# EAGLE design C128_Ultimate (EAGLE 9.0.1)
CNAME: Uffes Cart; CREVISION: 1.0; DESIGNER: Tomse @ http://retro-commodore.eu
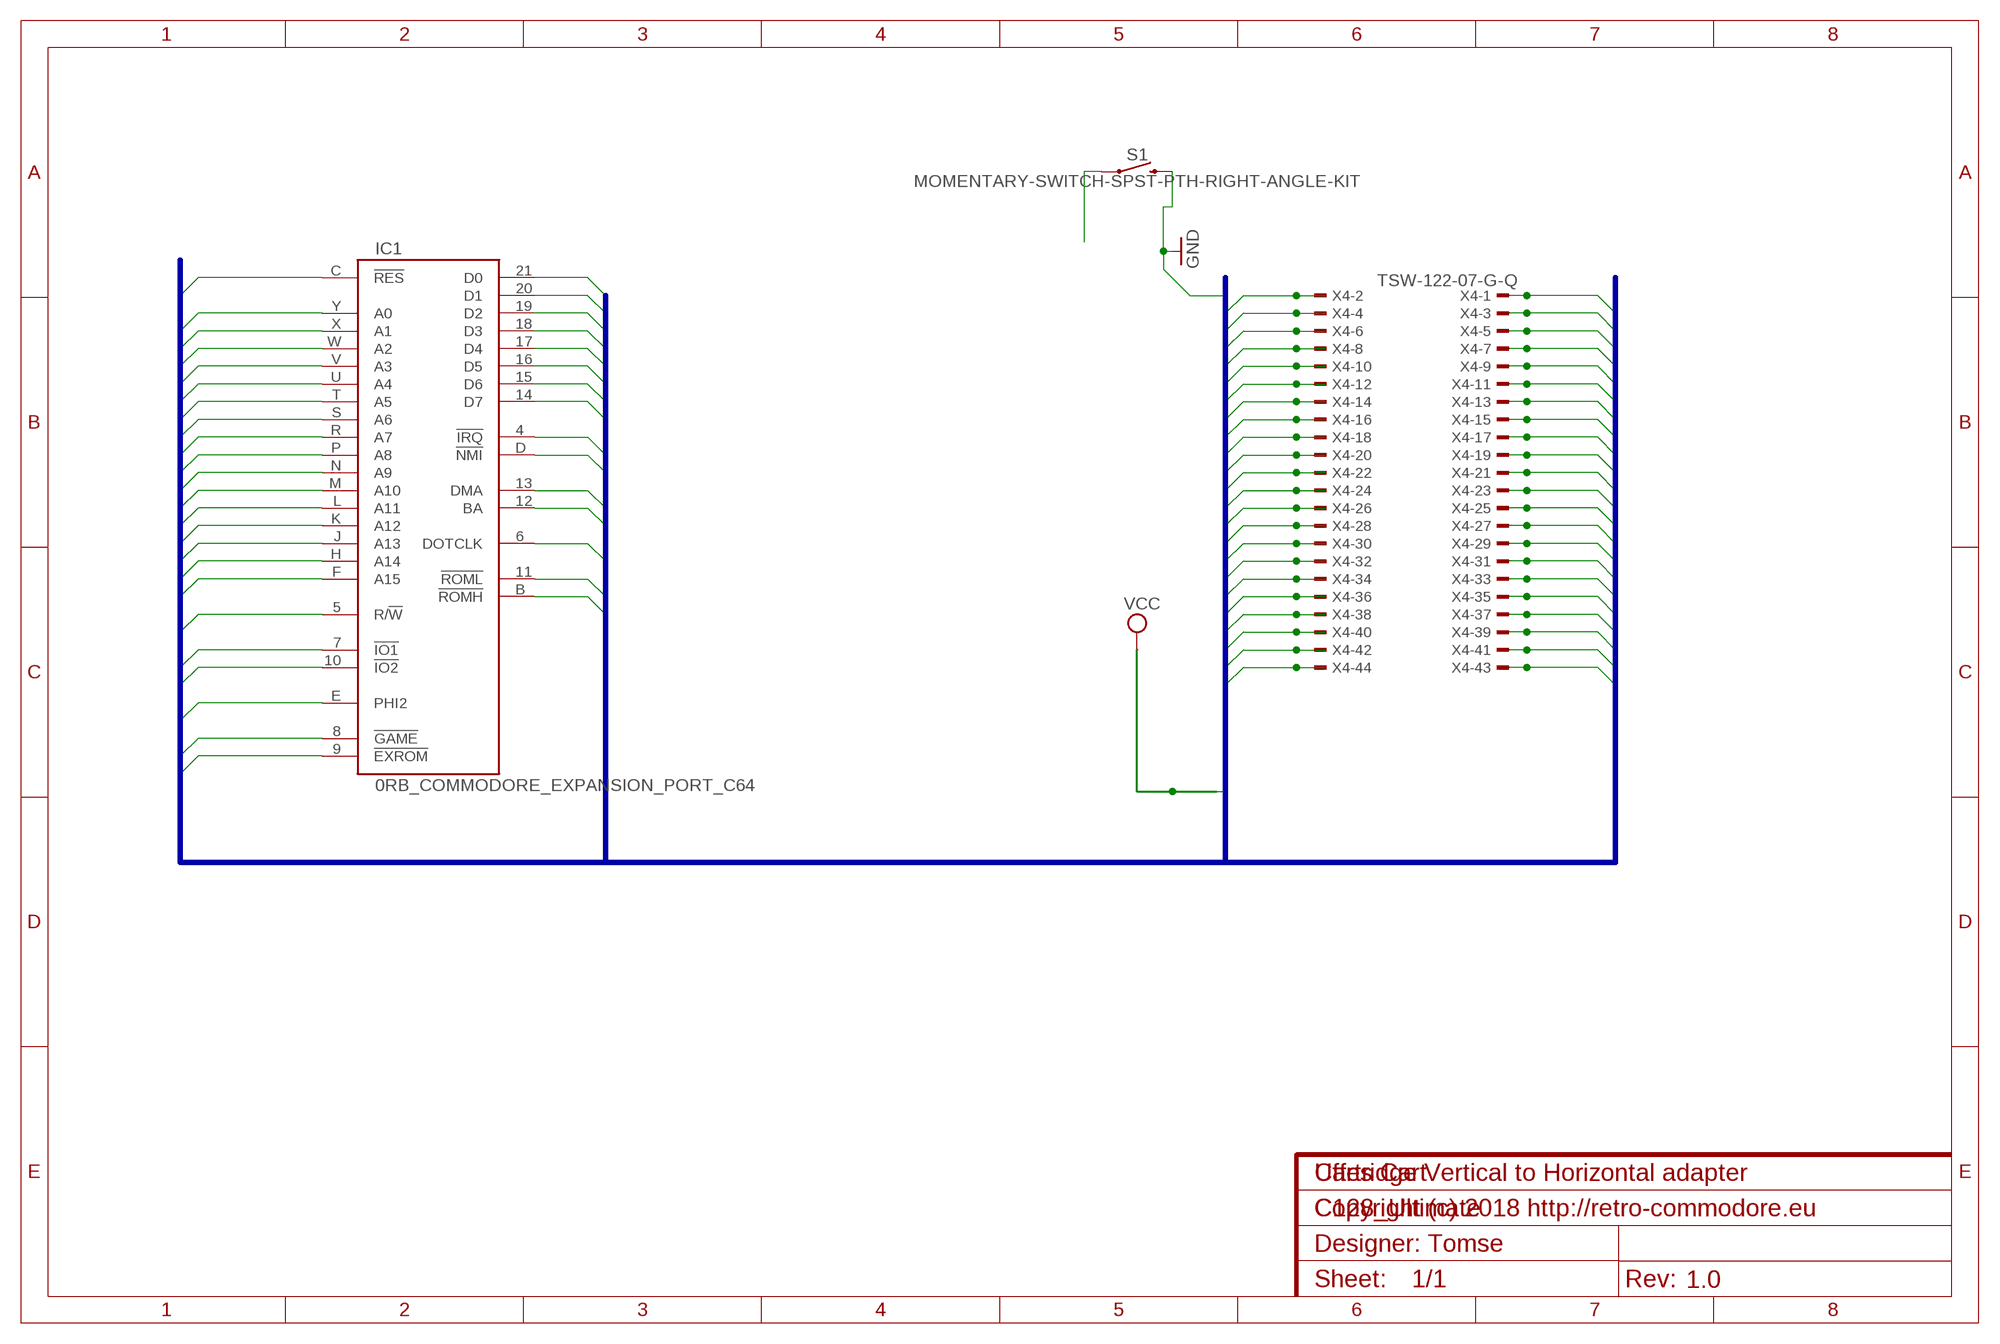
[diagram p0: schematic, sheet 1]
FRAME1 (FRAME-A4L): DESIGNER: Copyright (c) 2018 http://retro-commodore.eu

## Parts
IC1  0RB_COMMODORE_EXPANSION_PORT_C64  [0RB_COMMODORE_MA100-22-2]
S1  MOMENTARY-SWITCH-SPST-PTH-RIGHT-ANGLE-KIT  [TACTILE_SWITCH_PTH_RIGHT_ANGLE_KIT]
X4  TSW-122-07-G-Q  [TSW-122-XX-G-Q]

## Nets
!DMA: IC1.13(DMA) X4.26
!EXROM: IC1.9(!EXROM) X4.18
!GAME: IC1.8(!GAME) X4.16
!IO1: IC1.7(!IO1) X4.14
!IO2: IC1.10(!IO2) X4.20
!IRQ: IC1.4(!IRQ) X4.8
!NMI: IC1.D(!NMI) X4.7
!RES: IC1.C(!RES) S1.1 X4.5
!ROMH: IC1.B(!ROMH) X4.3
!ROML: IC1.11(!ROML) X4.22
A0: IC1.Y(A0) X4.41
A1: IC1.X(A1) X4.39
A2: IC1.W(A2) X4.37
A3: IC1.V(A3) X4.35
A4: IC1.U(A4) X4.33
A5: IC1.T(A5) X4.31
A6: IC1.S(A6) X4.29
A7: IC1.R(A7) X4.27
A8: IC1.P(A8) X4.25
A9: IC1.N(A9) X4.23
A10: IC1.M(A10) X4.21
A11: IC1.L(A11) X4.19
A12: IC1.K(A12) X4.17
A13: IC1.J(A13) X4.15
A14: IC1.H(A14) X4.13
A15: IC1.F(A15) X4.11
BA: IC1.12(BA) X4.24
D0: IC1.21(D0) X4.42
D1: IC1.20(D1) X4.40
D2: IC1.19(D2) X4.38
D3: IC1.18(D3) X4.36
D4: IC1.17(D4) X4.34
D5: IC1.16(D5) X4.32
D6: IC1.15(D6) X4.30
D7: IC1.14(D7) X4.28
DOTCLK: IC1.6(DOTCLK) X4.12
GND: S1.2 X4.1 X4.2 X4.43 X4.44
PHI2: IC1.E(PHI2) X4.9
R!W: IC1.5(R/!W) X4.10
VCC: X4.4 X4.6

## Buses
A0,A1,A2,A3,A4,A5,A6,A7,A8,A9,A10,A11,A12,A13,A14,A15,PHI2,!NMI,!RES,!ROMH,GND,D0,D1,D2,D3,D4,D5,D6,D7,VCC,!IRQ,R!W,DOTCLK,!IO1,!IO2,!GAME,!EXROM,!ROML,BA,!DMA

## Notes on the sheet
- Cartridge Vertical to Horizontal adapter
- Designer: Tomse

## Power pins joined to a net without a drawn wire
GND: IC1.1(GND) IC1.22(GND) IC1.A(GND) IC1.Z(GND)
VCC: IC1.2(VCC) IC1.3(VCC)

## Library data of the parts
IC1 = C64CartridgeEdgeConnector:0RB_COMMODORE_EXPANSION_PORT_C64
S1 = SparkFun-Switches:MOMENTARY-SWITCH-SPST: Momentary Switch (Pushbutton) - SPST Normally-open (NO) SPST momentary switches (buttons, pushbuttons). Variants PTH-12MM - 12mm square, through-hole Momentary Pushbutton Switch - 12mm Square <https://www.sparkfun.com/products/9190> (COM-09190) PTH-6.0MM, PTH-6.0MM-KIT - 6.0mm square, through-hole Mini Pushbutton Switch <https://www.sparkfun.com/products/97> (COM-00097) KIT package intended for soldering kit's - only one side of pads' copper is exposed. PTH-RIGHT-ANGLE-KIT - Right-angle, through-hole Right Angle Tactile Button <https://www.sparkfun.com/products/10791> - Used on SparkFun BigTime Watch Kit <https://www.sparkfun.com/products/11734> SMD-12MM - 12mm square, surface-mount Tactile Button - SMD (12mm) <https://www.sparkfun.com/products/12993> (COM-12993) Used on SparkFun PicoBoard <https://www.sparkfun.com/products/11888> SMD-4.5MM - 4.5mm Square Trackball Switch Used on SparkFun Blackberry Trackballer Breakout <https://www.sparkfun.com/products/13169> SMD-4.6MMX2.8MM - 4.60mm x 2.80mm, surface mount Used on SparkFun SAMD21 Mini Breakout <https://www.sparkfun.com/products/13664> SMD-5.2MM, SMD-5.2-REDUNDANT - 5.2mm square, surface-mount Mini Pushbutton Switch - SMD <https://www.sparkfun.com/products/8720> (COM-08720) Used on Arduino Pro Mini <https://www.sparkfun.com/products/11114> REDUNDANT package connects both switch circuits together SMD-6.0X3.5MM - 6.0 x 3.5mm, surface mount Momentary Reset Switch SMD <https://www.sparkfun.com/products/8229> (COM-08229) SMD-6.2MM-TALL - 6.2mm square, surface mount Tactile Button - SMD (6mm) <https://www.sparkfun.com/products/12992> Used on SparkFun Digital Sandbox <https://www.sparkfun.com/products/12651> SMD-RIGHT-ANGLE - Right-angle, surface mount Used on SparkFun Block for Intel® Edison - Arduino <https://www.sparkfun.com/products/13036>; PROD_ID: CONN-10672; SF_SKU: COM-10791
X4 = con-samtec:TSW-122-*-G: THROUGH-HOLE .025" SQ POST HEADER Source: Samtec TSW.pdf; MF: Samtec Inc.; MPN: TSW-122-07-G-Q

## Net classes
0 default: clearance 0.205 mm

## Board
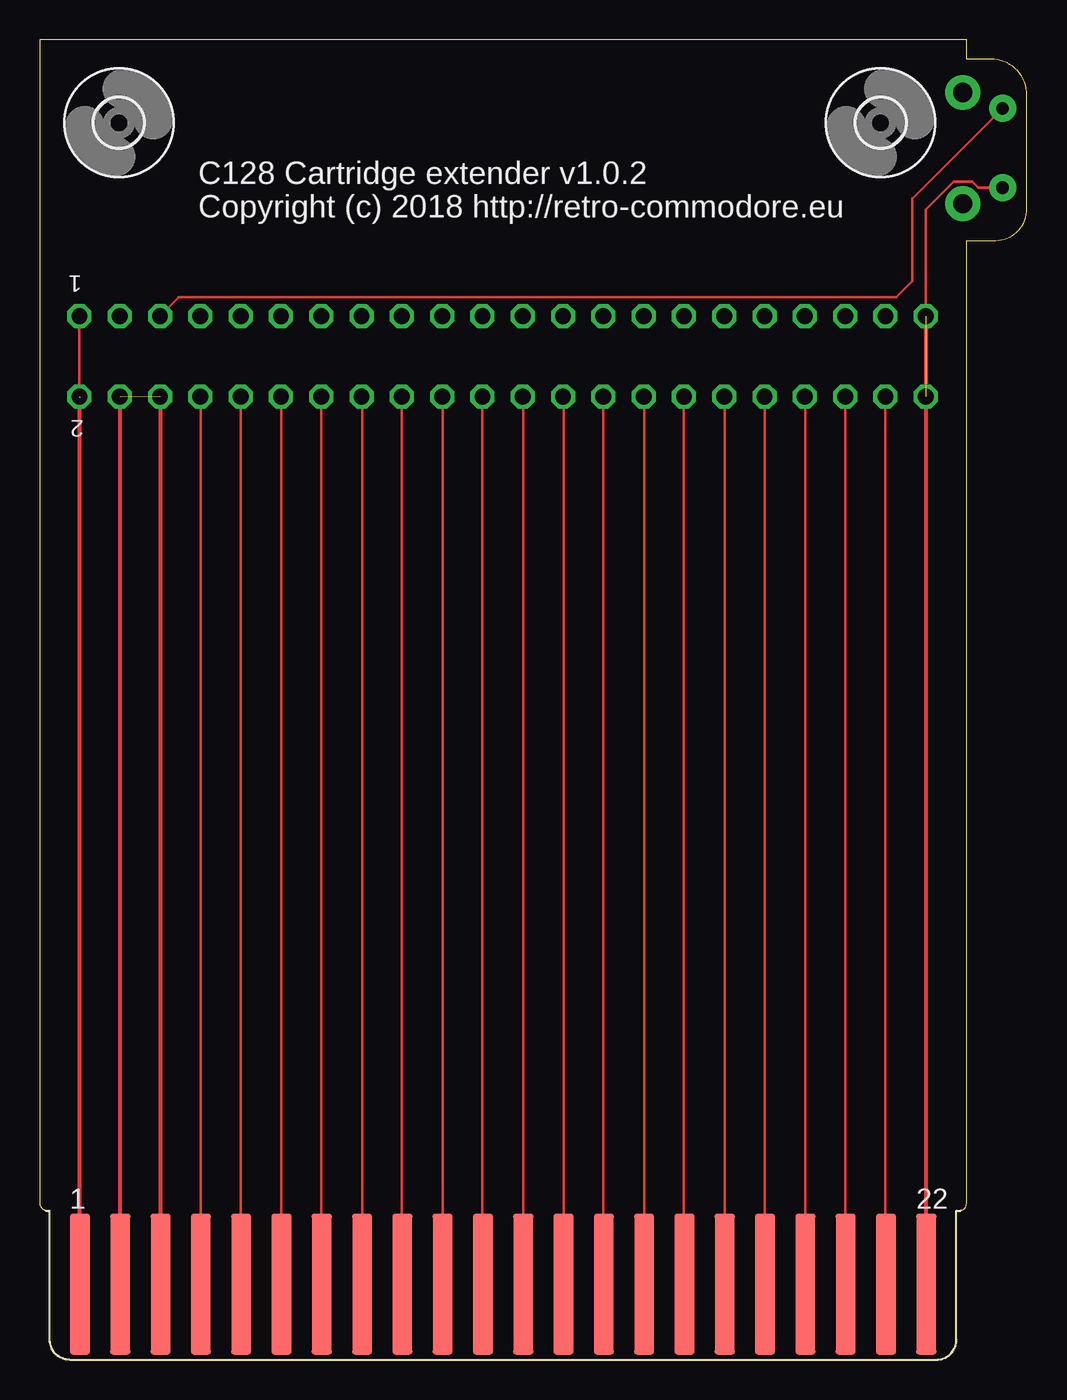
[diagram p1: board, top side]
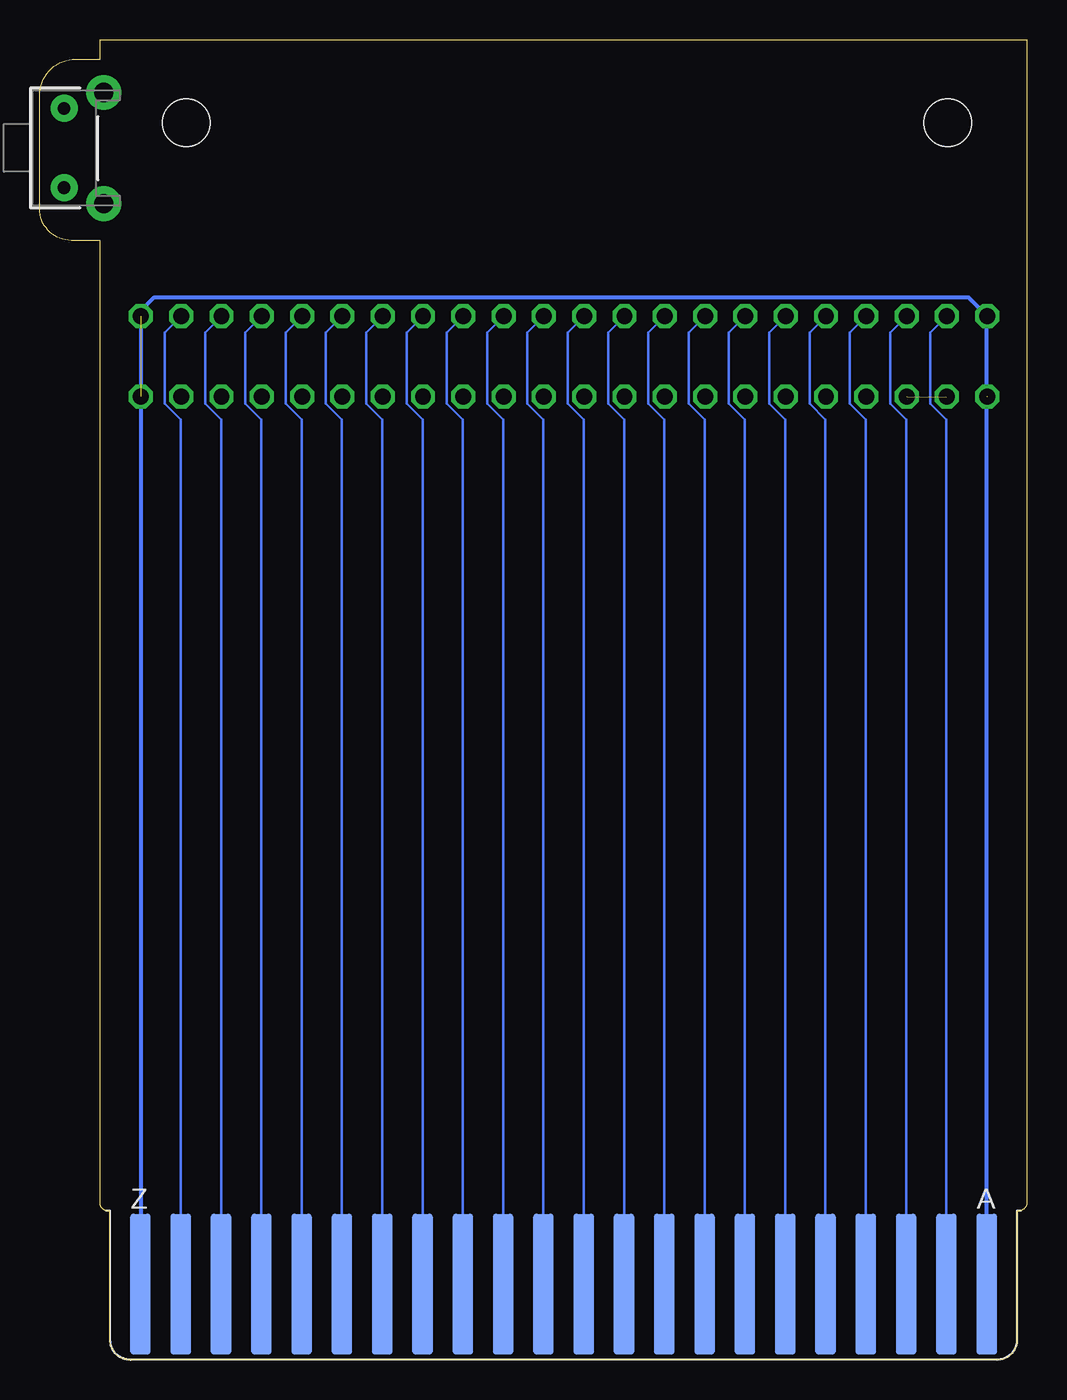
[diagram p2: board, bottom side, seen from below]

Size 62.23 x 83.24 mm. Coordinates in mm from the lower left corner, seen from the top.
Outline: 0.64,9.3 0.64,1.24 arc90 1.87,0 56.52,0 arc90 57.8,1.28 57.8,9.29 arc-90 57.91,9.4 57.94,9.4 arc90 58.42,9.87 58.42,70.58 60.24,70.58 arc90 62.23,72.57 62.23,79.74 arc90 59.96,82.01 58.42,82.01 58.42,83.24 0,83.24 0,9.93 arc90 0.53,9.4 arc-90 0.64,9.3
Copper layers (1*16): Top 0.035mm / dielectric 1.5mm / Bottom 0.035mm
Design rules "default *": minimum track width 6mil, minimum drill 0.35mm, track to track 6mil, track to pad 6mil, pad to pad 6mil, via to via 6mil, smd to smd 6mil, copper to edge 0.32mm, drill to drill 6mil, minimum pad ring 10mil, minimum via ring 8mil, stop-mask expansion 4mil, vias tented up to drill 0mil, thermal gap 10mil

### Footprints (pad centres in the part's own frame; a part is rotated, then mirrored left to right if it is on the bottom)
0RB_COMMODORE_MA100-22-2 = smd 1.27 x 8.89: 1 -26.67,-0.305; 2 -24.13,-0.305; 3 -21.59,-0.305; 4 -19.05,-0.305; 5 -16.51,-0.305; 6 -13.97,-0.305; 7 -11.43,-0.305; 8 -8.89,-0.305; 9 -6.35,-0.305; 10 -3.81,-0.305; 11 -1.27,-0.305; 12 1.27,-0.305; 13 3.81,-0.305; 14 6.35,-0.305; 15 8.89,-0.305; 16 11.43,-0.305; 17 13.97,-0.305; 18 16.51,-0.305; 19 19.05,-0.305; 20 21.59,-0.305; 21 24.13,-0.305; 22 26.67,-0.305 | smd 1.27 x 8.89 bottom: A -26.67,-0.305; B -24.13,-0.305; C -21.59,-0.305; D -19.05,-0.305; E -16.51,-0.305; F -13.97,-0.305; H -11.43,-0.305; J -8.89,-0.305; K -6.35,-0.305; L -3.81,-0.305; M -1.27,-0.305; N 1.27,-0.305; P 3.81,-0.305; R 6.35,-0.305; S 8.89,-0.305; T 11.43,-0.305; U 13.97,-0.305; V 16.51,-0.305; W 19.05,-0.305; X 21.59,-0.305; Y 24.13,-0.305; Z 26.67,-0.305
TACTILE_SWITCH_PTH_RIGHT_ANGLE_KIT = drill 0.8 pad 1.7: 1 -2.5,0; 2 2.5,0 | drill 1.2 pad 2.2: ANCHOR1 -3.5,2.5; ANCHOR2 3.5,2.5
3,0 = hole 3: 0,0
TSW-122-XX-G-Q = drill 1 pad 1.5 octagon: 1 26.67,-2.54; 2 26.67,2.54; 3 24.13,-2.54; 4 24.13,2.54; 5 21.59,-2.54; 6 21.59,2.54; 7 19.05,-2.54; 8 19.05,2.54; 9 16.51,-2.54; 10 16.51,2.54; 11 13.97,-2.54; 12 13.97,2.54; 13 11.43,-2.54; 14 11.43,2.54; 15 8.89,-2.54; 16 8.89,2.54; 17 6.35,-2.54; 18 6.35,2.54; 19 3.81,-2.54; 20 3.81,2.54; 21 1.27,-2.54; 22 1.27,2.54; 23 -1.27,-2.54; 24 -1.27,2.54; 25 -3.81,-2.54; 26 -3.81,2.54; 27 -6.35,-2.54; 28 -6.35,2.54; 29 -8.89,-2.54; 30 -8.89,2.54; 31 -11.43,-2.54; 32 -11.43,2.54; 33 -13.97,-2.54; 34 -13.97,2.54; 35 -16.51,-2.54; 36 -16.51,2.54; 37 -19.05,-2.54; 38 -19.05,2.54; 39 -21.59,-2.54; 40 -21.59,2.54; 41 -24.13,-2.54; 42 -24.13,2.54; 43 -26.67,-2.54; 44 -26.67,2.54

### Placement (x,y rotation side)
IC1  29.21,5.08 0 top
S1  60.69,76.41 270 bottom
U$1  [3,0]  5,78 0 top
U$2  [3,0]  53,78 0 top
X4  29.18,63.27 180 top

### Tracks (layer width: path | path; a pad name or v marks a point on that pad's centre or on a via)
!DMA
  Top 0.152: IC1.13 33.02,60.7 X4.26
!EXROM
  Top 0.152: X4.18 22.83,4.81 IC1.9
!GAME
  Top 0.152: IC1.8 20.32,60.7 X4.16
!IO1
  Top 0.152: X4.14 17.75,4.81 IC1.7
!IO2
  Top 0.152: IC1.10 25.4,60.7 X4.20
!IRQ
  Top 0.152: IC1.4 10.16,60.7 X4.8
!NMI
  Bottom 0.152: IC1.D 10.16,59.3 11.16,60.3 11.16,64.77 X4.7
!RES
  Top 0.152: X4.5 8.78,67 54,67 55,68 55,70 55,73.22 S1.1
  Bottom 0.152: IC1.C 7.62,59.3 8.62,60.3 8.62,64.77 X4.5
!ROMH
  Bottom 0.152: IC1.B 5.08,59.3 6.08,60.3 6.08,64.77 X4.3
!ROML
  Top 0.152: X4.22 27.91,4.81 IC1.11
A0
  Bottom 0.152: IC1.Y 53.34,59.3 54.34,60.3 54.34,64.77 X4.41
A1
  Bottom 0.152: IC1.X 50.8,59.3 51.8,60.3 51.8,64.77 X4.39
A2
  Bottom 0.152: IC1.W 48.26,59.3 49.26,60.3 49.26,64.77 X4.37
A3
  Bottom 0.152: IC1.V 45.72,59.3 46.72,60.3 46.72,64.77 X4.35
A4
  Bottom 0.152: IC1.U 43.18,59.3 44.18,60.3 44.18,64.77 X4.33
A5
  Bottom 0.152: IC1.T 40.64,59.3 41.64,60.3 41.64,64.77 X4.31
A6
  Bottom 0.152: IC1.S 38.1,59.3 39.1,60.3 39.1,64.77 X4.29
A7
  Bottom 0.152: IC1.R 35.56,59.3 36.56,60.3 36.56,64.77 X4.27
A8
  Bottom 0.152: IC1.P 33.02,59.3 34.02,60.3 34.02,64.77 X4.25
A9
  Bottom 0.152: IC1.N 30.48,59.3 31.48,60.3 31.48,64.77 X4.23
A10
  Bottom 0.152: IC1.M 27.94,59.3 28.94,60.3 28.94,64.77 X4.21
A11
  Bottom 0.152: IC1.L 25.4,59.3 26.4,60.3 26.4,64.77 X4.19
A12
  Bottom 0.152: IC1.K 22.86,59.3 23.86,60.3 23.86,64.77 X4.17
A13
  Bottom 0.152: IC1.J 20.32,59.3 21.32,60.3 21.32,64.77 X4.15
A14
  Bottom 0.152: IC1.H 17.78,59.3 18.78,60.3 18.78,64.77 X4.13
A15
  Bottom 0.152: IC1.F 15.24,59.3 16.24,60.3 16.24,64.77 X4.11
BA
  Top 0.152: IC1.12 30.48,60.7 X4.24
D0
  Top 0.152: X4.42 53.31,4.81 IC1.21
D1
  Top 0.152: X4.40 50.77,4.81 IC1.20
D2
  Top 0.152: IC1.19 48.26,60.7 X4.38
D3
  Top 0.152: X4.36 45.69,4.81 IC1.18
D4
  Top 0.152: IC1.17 43.18,60.7 X4.34
D5
  Top 0.152: X4.32 40.61,4.81 IC1.16
D6
  Top 0.152: IC1.15 38.1,60.7 X4.30
D7
  Top 0.152: X4.28 35.53,4.81 IC1.14
DOTCLK
  Top 0.152: IC1.6 15.24,60.7 X4.12
GND  (2 unrouted)
  Top 0.152: 2.54,60.7 2.54,60 2.51,60.03 X4.1 | 55.85,4.81 IC1.Z | X4.43 55.85,72.52 57.62,74.29 58.77,74.29 59.15,73.91 S1.2
  Top 0.254: IC1.A 2.54,60 | X4.43 55.85,4.81
  Bottom 0.152: 2.54,65.78 X4.1 | 55.85,4.81 IC1.Z | X4.43 55.85,66.15
  Bottom 0.254: IC1.A 2.54,65.78 | X4.43 55.85,4.81 | 55.85,66.15 55,67 3.7,67 X4.1
PHI2
  Bottom 0.152: IC1.E 12.7,59.3 13.7,60.3 13.7,64.77 X4.9
R!W
  Top 0.152: X4.10 12.67,4.81 IC1.5
VCC  (1 unrouted)
  Top 0.152: 5.08,60.7 X4.4 | 7.59,4.81 IC1.3
  Top 0.254: IC1.2 5.08,60.7 | X4.6 7.59,4.81

### Text on the board
tNames: C128 Cartridge extender v1.0.2 / Copyright (c) 2018 http://retro-commodore.eu